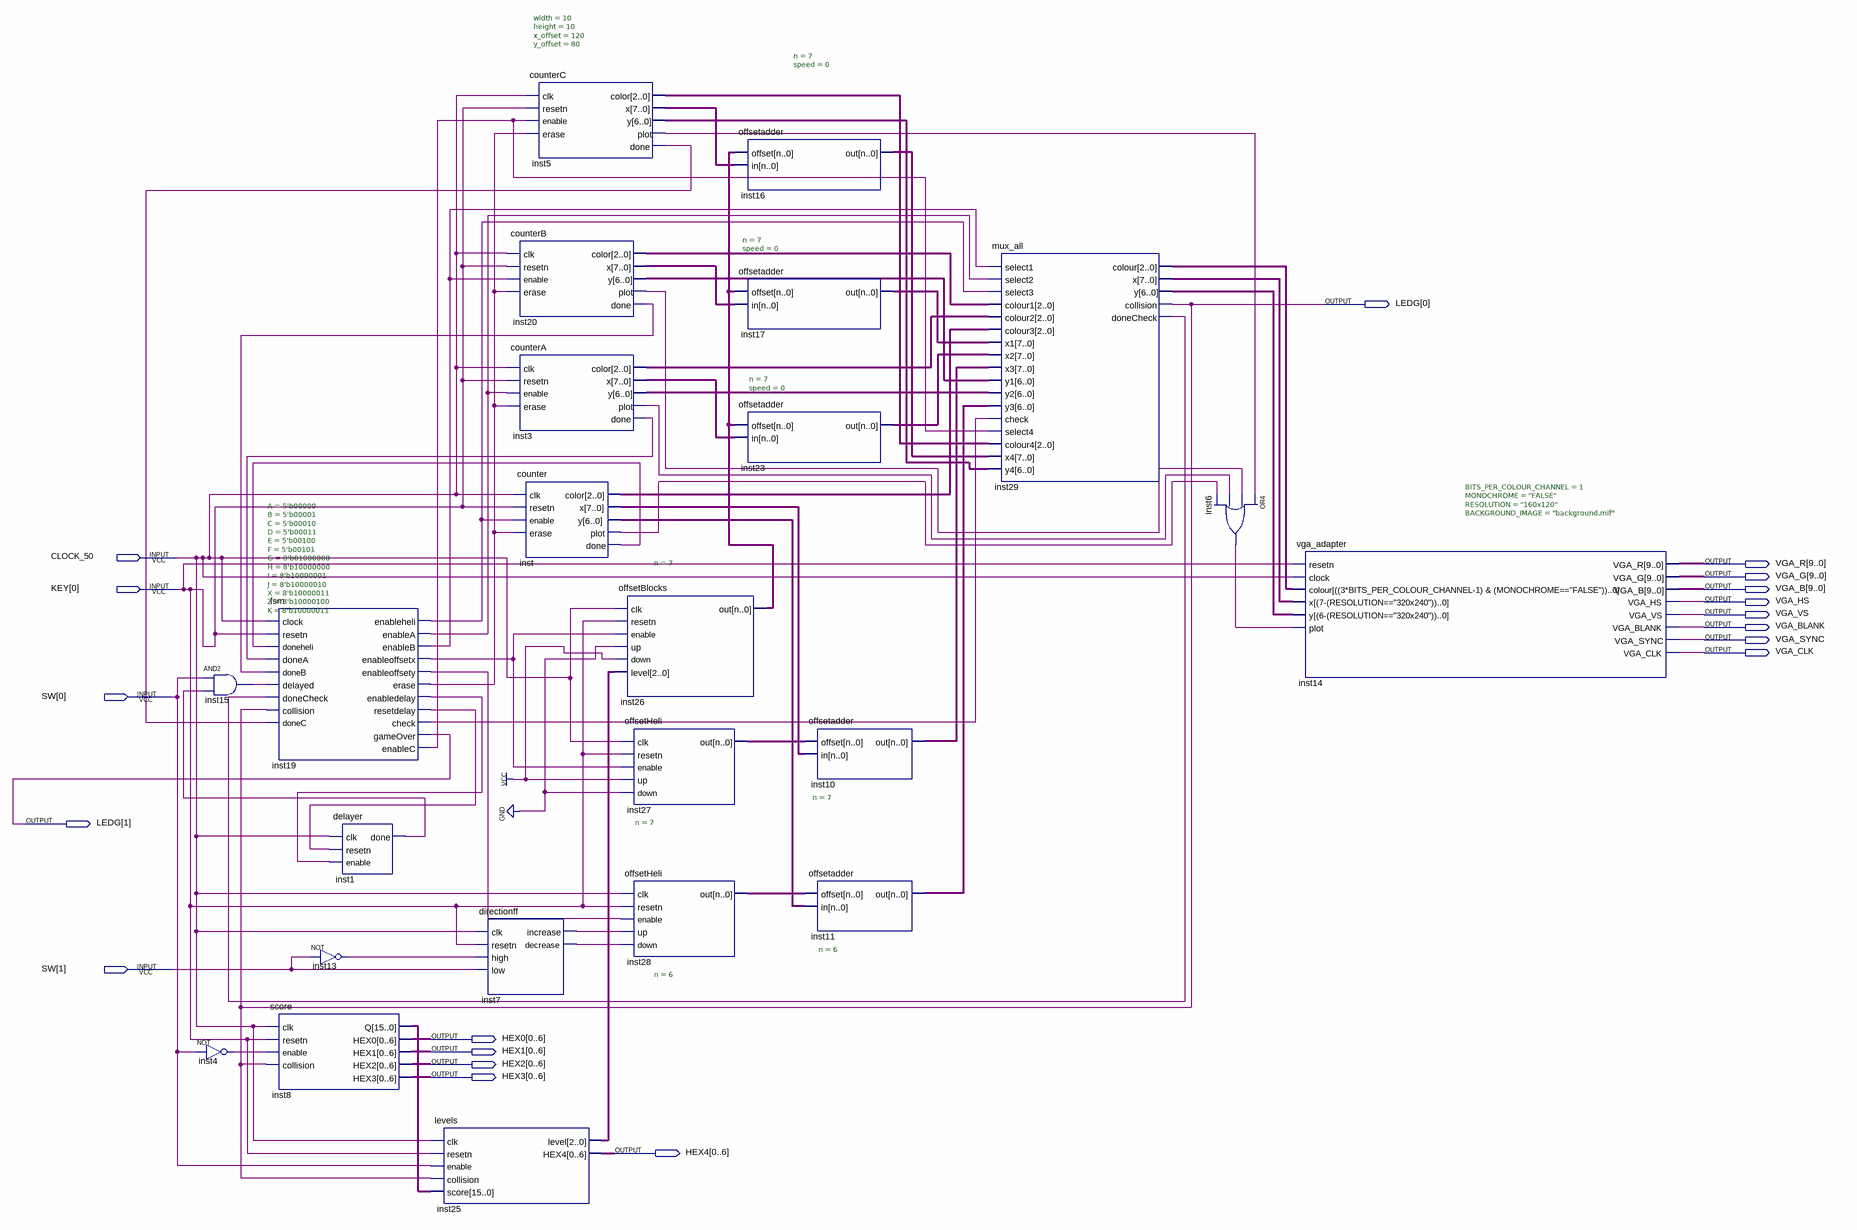
[diagram p0: schematic sheet]
// Quartus schematic animation.bdf as structural Verilog: 23 symbols, 19 pins
module animation (
  input  CLOCK_50,
  input  [0:0] KEY,
  input  [1:0] SW,
  output [1:0] LEDG,
  output [9:0] VGA_R,
  output [9:0] VGA_G,
  output [9:0] VGA_B,
  output VGA_HS,
  output VGA_VS,
  output VGA_BLANK,
  output VGA_SYNC,
  output VGA_CLK,
  output [0:6] HEX0,
  output [0:6] HEX1,
  output [0:6] HEX2,
  output [0:6] HEX3,
  output [0:6] HEX4
);

  wire inst1_done, inst3_done, inst3_plot, inst4_out, inst5_done, inst5_plot, inst6_out, inst7_decrease,
       inst7_increase, inst13_out, inst15_out, inst19_check, inst19_enablea, inst19_enableb, inst19_enablec,
       inst19_enabledelay, inst19_enableheli, inst19_enableoffsetx, inst19_enableoffsety, inst19_erase,
       inst19_resetdelay, inst20_done, inst20_plot, inst29_donecheck, inst_done, inst_plot;
  wire [2:0] inst3_color, inst5_color, inst20_color, inst25_level, inst29_colour, inst_color;
  wire [6:0] inst3_y, inst5_y, inst11_out, inst20_y, inst28_out, inst29_y, inst_y;
  wire [7:0] inst3_x, inst5_x, inst10_out, inst16_out, inst17_out, inst20_x, inst23_out, inst26_out,
       inst27_out, inst29_x, inst_x;
  wire [15:0] inst8_q;

  not inst4 (inst4_out, SW[0]);
  and inst15 (inst15_out, SW[0], inst1_done);
  fsm #(.A(5'b00000), .B(5'b00001), .C(5'b00010), .D(5'b00011), .E(5'b00100), .F(5'b00101), .G(8'b01000000), .H(8'b10000000), .I(8'b10000001), .J(8'b10000010), .X(8'b10000011), .Z(8'b10000100), .K(8'b10000011)) inst19 (
    .clock(CLOCK_50), .resetn(KEY[0]), .doneheli(inst_done), .doneA(inst3_done), .doneB(inst20_done),
    .delayed(inst15_out), .doneCheck(inst29_donecheck), .collision(LEDG[0]), .doneC(inst5_done),
    .enableheli(inst19_enableheli), .enableA(inst19_enablea), .enableB(inst19_enableb),
    .enableoffsetx(inst19_enableoffsetx), .enableoffsety(inst19_enableoffsety), .erase(inst19_erase),
    .enabledelay(inst19_enabledelay), .resetdelay(inst19_resetdelay), .check(inst19_check),
    .gameOver(LEDG[1]), .enableC(inst19_enablec));
  score inst8 (
    .clk(CLOCK_50), .resetn(KEY[0]), .enable(inst4_out), .collision(LEDG[0]), .Q(inst8_q), .HEX0(HEX0),
    .HEX1(HEX1), .HEX2(HEX2), .HEX3(HEX3));
  delayer inst1 (.clk(CLOCK_50), .resetn(inst19_resetdelay), .enable(inst19_enabledelay), .done(inst1_done));
  not inst13 (inst13_out, SW[1]);
  levels inst25 (
    .clk(CLOCK_50), .resetn(KEY[0]), .enable(SW[0]), .collision(LEDG[0]), .score(inst8_q),
    .level(inst25_level), .HEX4(HEX4));
  directionff inst7 (
    .clk(CLOCK_50), .resetn(KEY[0]), .high(inst13_out), .low(SW[1]), .increase(inst7_increase),
    .decrease(inst7_decrease));
  counterC #(.width(10), .height(10), .x_offset(120), .y_offset(80)) inst5 (
    .clk(CLOCK_50), .resetn(KEY[0]), .enable(inst19_enablec), .erase(inst19_erase), .color(inst5_color),
    .x(inst5_x), .y(inst5_y), .plot(inst5_plot), .done(inst5_done));
  counterB inst20 (
    .clk(CLOCK_50), .resetn(KEY[0]), .enable(inst19_enableb), .erase(inst19_erase), .color(inst20_color),
    .x(inst20_x), .y(inst20_y), .plot(inst20_plot), .done(inst20_done));
  counterA inst3 (
    .clk(CLOCK_50), .resetn(KEY[0]), .enable(inst19_enablea), .erase(inst19_erase), .color(inst3_color),
    .x(inst3_x), .y(inst3_y), .plot(inst3_plot), .done(inst3_done));
  counter inst (
    .clk(CLOCK_50), .resetn(KEY[0]), .enable(inst19_enableheli), .erase(inst19_erase), .color(inst_color),
    .x(inst_x), .y(inst_y), .plot(inst_plot), .done(inst_done));
  offsetBlocks #(.n(7)) inst26 (
    .clk(CLOCK_50), .resetn(KEY[0]), .enable(inst19_enableoffsetx), .up(1'b0), .down(1'b1),
    .level(inst25_level), .out(inst26_out));
  offsetHeli #(.n(7)) inst27 (
    .clk(CLOCK_50), .resetn(KEY[0]), .enable(inst19_enableoffsetx), .up(1'b1), .down(1'b0), .out(inst27_out));
  offsetHeli #(.n(6)) inst28 (
    .clk(CLOCK_50), .resetn(KEY[0]), .enable(inst19_enableoffsety), .up(inst7_increase),
    .down(inst7_decrease), .out(inst28_out));
  offsetadder #(.n(7), .speed(0)) inst16 (.offset(inst26_out), .in(inst5_x), .out(inst16_out));
  offsetadder #(.n(7), .speed(0)) inst17 (.offset(inst26_out), .in(inst20_x), .out(inst17_out));
  offsetadder #(.n(7), .speed(0)) inst23 (.offset(inst26_out), .in(inst3_x), .out(inst23_out));
  offsetadder #(.n(7)) inst10 (.offset(inst27_out), .in(inst_x), .out(inst10_out));
  offsetadder #(.n(6)) inst11 (.offset(inst28_out), .in(inst_y), .out(inst11_out));
  mux_all inst29 (
    .select1(inst19_enableb), .select2(inst19_enablea), .select3(inst19_enableheli), .colour1(inst20_color),
    .colour2(inst3_color), .colour3(inst_color), .x1(inst17_out), .x2(inst23_out), .x3(inst10_out),
    .y1(inst20_y), .y2(inst3_y), .y3(inst11_out), .check(inst19_check), .select4(inst19_enablec),
    .colour4(inst5_color), .x4(inst16_out), .y4(inst5_y), .colour(inst29_colour), .x(inst29_x), .y(inst29_y),
    .collision(LEDG[0]), .doneCheck(inst29_donecheck));
  or inst6 (inst6_out, inst5_plot, inst20_plot, inst3_plot, inst_plot);
  vga_adapter #(.BITS_PER_COLOUR_CHANNEL(1), .MONOCHROME("FALSE"), .RESOLUTION("160x120"), .BACKGROUND_IMAGE("background.mif")) inst14 (
    .resetn(KEY[0]), .clock(CLOCK_50), .plot(inst6_out), .x(inst29_x), .y(inst29_y), .colour(inst29_colour),
    .VGA_R(VGA_R), .VGA_G(VGA_G), .VGA_B(VGA_B), .VGA_HS(VGA_HS), .VGA_VS(VGA_VS), .VGA_BLANK(VGA_BLANK),
    .VGA_SYNC(VGA_SYNC), .VGA_CLK(VGA_CLK));
endmodule
